# Altium schematic sheet IO_Connector.SchDoc
size A3; CompanyName: Group 19 - AIgle; DrawnBy: Danny Huang; SheetNumber: 1; SheetTotal: 3
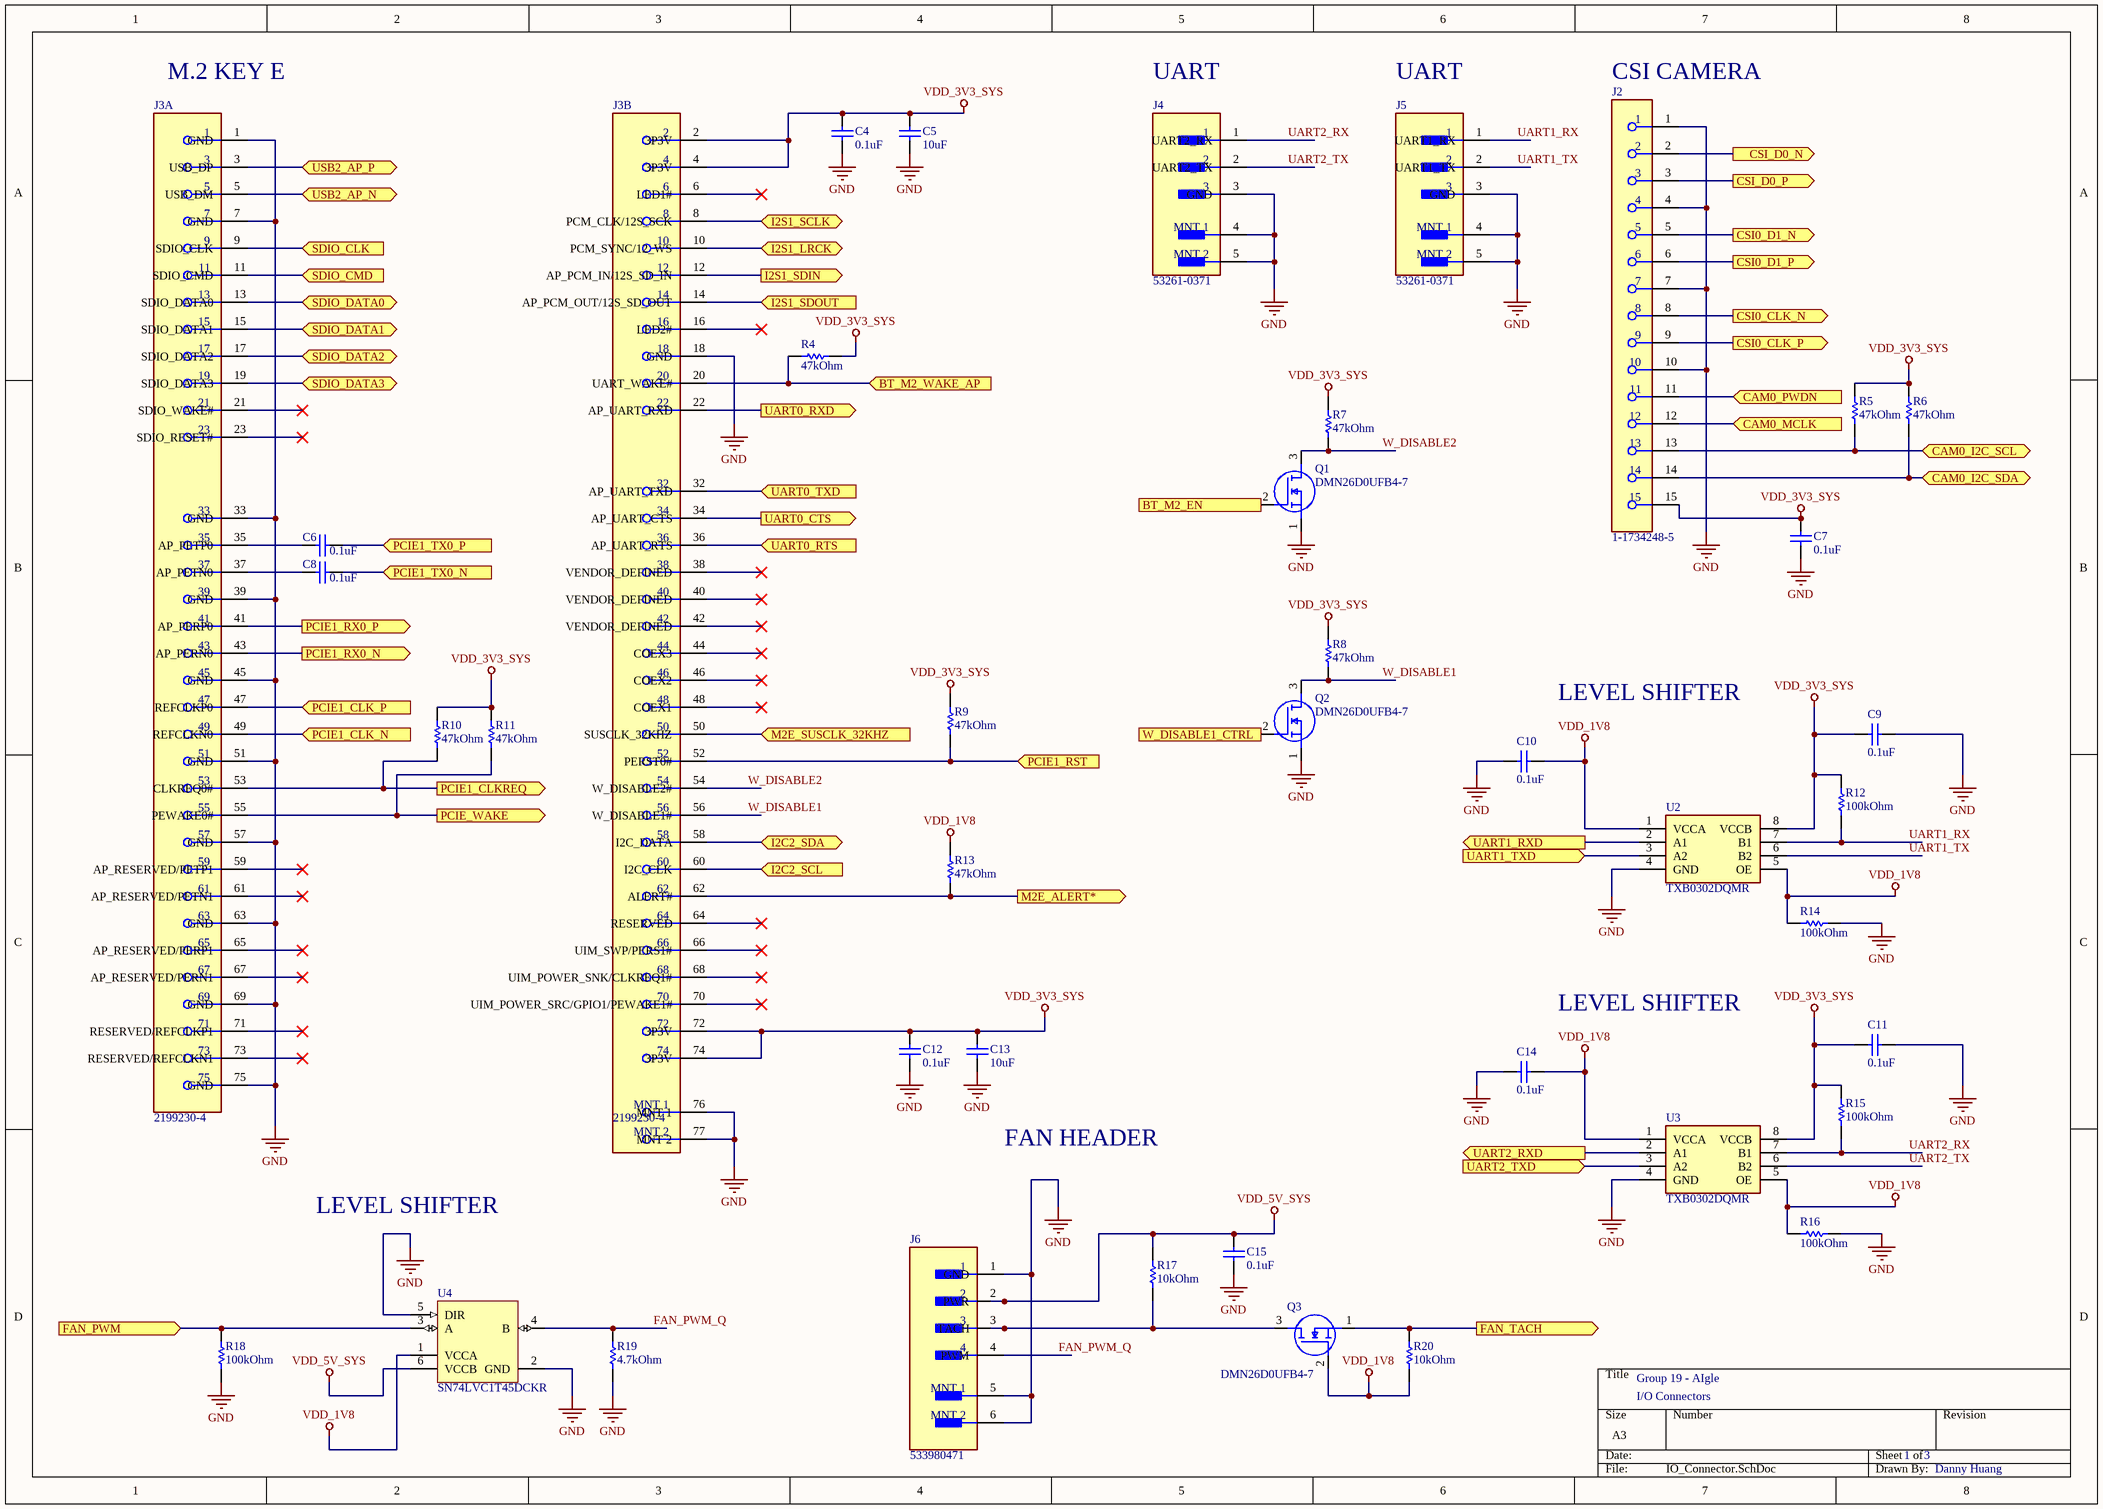
[diagram p0: IO_Connector.SchDoc]

## Parts
C4  0.1uF  [CAPC1005X55X30NL05T10]
C5  10uF  [CAPC1608X90X35NL10T15]
C6  0.1uF  [CAPC1005X55X30NL05T10]
C7  0.1uF  [CAPC1005X55X30NL05T10]
C8  0.1uF  [CAPC1005X55X30NL05T10]
C9  0.1uF  [CAPC1005X55X30NL05T10]
C10  0.1uF  [CAPC1005X55X30NL05T10]
C11  0.1uF  [CAPC1005X55X30NL05T10]
C12  0.1uF  [CAPC1005X55X30NL05T10]
C13  10uF  [CAPC1608X90X35NL10T15]
C14  0.1uF  [CAPC1005X55X30NL05T10]
C15  0.1uF  [CAPC1005X55X30NL05T10]
J2  1-1734248-5  [FP-1-1734248-5-MFG]
J3  2199230-4  [FP-2199230-4-MFG]  (parts A,B of 2)
J4  53261-0371  [FP-53261-0371-MFG]
J5  53261-0371  [FP-53261-0371-MFG]
J6  533980471  [FP-533980471-MFG]
Q1  DMN26D0UFB4-7  [DMN26D0UFB47]
Q2  DMN26D0UFB4-7  [DMN26D0UFB47]
Q3  DMN26D0UFB4-7  [DMN26D0UFB47]
R4  47kOhm  [RESC1005X40X25LL05T05]
R5  47kOhm  [RESC1005X40X25LL05T05]
R6  47kOhm  [RESC1005X40X25LL05T05]
R7  47kOhm  [RESC1005X40X25LL05T05]
R8  47kOhm  [RESC1005X40X25LL05T05]
R9  47kOhm  [RESC1005X40X25LL05T05]
R10  47kOhm  [RESC1005X40X25LL05T05]
R11  47kOhm  [RESC1005X40X25LL05T05]
R12  100kOhm  [RESC1005X40X25ML05T05]
R13  47kOhm  [RESC1005X40X25LL05T05]
R14  100kOhm  [RESC1005X40X25ML05T05]
R15  100kOhm  [RESC1005X40X25ML05T05]
R16  100kOhm  [RESC1005X40X25ML05T05]
R17  10kOhm  [RESC1005X40X25NL05T05]
R18  100kOhm  [RESC1005X40X25ML05T05]
R19  4.7kOhm  [RESC1005X40X25ML05T05]
R20  10kOhm  [RESC1005X40X25NL05T05]
U2  TXB0302DQMR  [SON40P120X180X40-8N]
U3  TXB0302DQMR  [SON40P120X180X40-8N]
U4  SN74LVC1T45DCKR  [DCK0006A_L]

## Ports
BT_M2_EN (in), BT_M2_WAKE_AP (in), CAM0_I2C_SCL (bidir), CAM0_I2C_SDA (bidir), CAM0_MCLK (in), CAM0_PWDN (in), CSI0_CLK_N (out), CSI0_CLK_P (out), CSI0_D1_N (out), CSI0_D1_P (out), CSI_D0_N (out), CSI_D0_P (out), FAN_PWM (in), FAN_TACH (out), I2C2_SCL (in), I2C2_SDA (bidir), I2S1_LRCK (bidir), I2S1_SCLK (bidir), I2S1_SDIN (out), I2S1_SDOUT (in), M2E_ALERT* (out), M2E_SUSCLK_32KHZ (in), PCIE1_CLK_N (in), PCIE1_CLK_P (in), PCIE1_CLKREQ (out), PCIE1_RST (in), PCIE1_RX0_N (out), PCIE1_RX0_P (out), PCIE1_TX0_N (in), PCIE1_TX0_P (in), PCIE_WAKE (out), SDIO_CLK (in), SDIO_CMD (in), SDIO_DATA0 (bidir), SDIO_DATA1 (bidir), SDIO_DATA2 (bidir), SDIO_DATA3 (bidir), UART0_CTS (out), UART0_RTS (in), UART0_RXD (out), UART0_TXD (in), UART1_RXD (out), UART1_TXD (in), UART2_RXD (out), UART2_TXD (in), USB2_AP_N (bidir), USB2_AP_P (bidir), W_DISABLE1_CTRL (in)

## Nets
GND: C4.1 C5.1 C7.1 C9.1 C10.2 C11.1 C12.1 C13.1 C14.2 C15.2 J2.1 J2.4 J2.7 J2.10 J3.1(GND) J3.7(GND) J3.18(GND) J3.33(GND) J3.39(GND) J3.45(GND) J3.51(GND) J3.57(GND) J3.63(GND) J3.69(GND) J3.75(GND) J3.76(MNT_1) J3.77(MNT_2) J4.3(GND) J4.4(MNT_1) J4.5(MNT_2) J5.3(GND) J5.4(MNT_1) J5.5(MNT_2) J6.1(GND) J6.5(MNT_1) J6.6(MNT_2) Q1.1(S) Q2.1(S) R14.1 R16.1 R18.2 R19.1 U2.4(GND) U3.4(GND) U4.2(GND) U4.5(DIR)
VDD_1V8: C10.1 C14.1 Q3.2(G) R13.2 R14.2 R16.2 R20.1 U2.1(VCCA) U2.5(OE) U3.1(VCCA) U3.5(OE) U4.1(VCCA)
VDD_3V3_SYS: C4.2 C5.2 C7.2 C9.2 C11.2 C12.2 C13.2 J2.15 J3.2(3P3V) J3.4(3P3V) J3.72(3P3V) J3.74(3P3V) R4.1 R5.2 R6.2 R7.2 R8.2 R9.2 R10.2 R11.2 R12.2 R15.2 U2.8(VCCB) U3.8(VCCB)
VDD_5V_SYS: C15.1 J6.2(PWR) R17.2 U4.6(VCCB)
BT_M2_EN: Q1.2(G) ; port BT_M2_EN
BT_M2_WAKE_AP: J3.20(UART_WAKE#) R4.2 ; port BT_M2_WAKE_AP
CAM0_I2C_SCL: J2.13 R5.1 ; port CAM0_I2C_SCL
CAM0_I2C_SDA: J2.14 R6.1 ; port CAM0_I2C_SDA
CAM0_MCLK: J2.12 ; port CAM0_MCLK
CAM0_PWDN: J2.11 ; port CAM0_PWDN
CSI0_CLK_N: J2.8 ; port CSI0_CLK_N
CSI0_CLK_P: J2.9 ; port CSI0_CLK_P
CSI0_D1_N: J2.5 ; port CSI0_D1_N
CSI0_D1_P: J2.6 ; port CSI0_D1_P
CSI_D0_N: J2.2 ; port CSI_D0_N
CSI_D0_P: J2.3 ; port CSI_D0_P
FAN_PWM: R18.1 U4.3(A) ; port FAN_PWM
FAN_PWM_Q: J6.4(PWM) R19.2 U4.4(B)
FAN_TACH: Q3.1(S) R20.2 ; port FAN_TACH
I2C2_SCL: J3.60(I2C_CLK) ; port I2C2_SCL
I2C2_SDA: J3.58(I2C_DATA) ; port I2C2_SDA
I2S1_LRCK: J3.10(PCM_SYNC/12_WS) ; port I2S1_LRCK
I2S1_SCLK: J3.8(PCM_CLK/12S_SCK) ; port I2S1_SCLK
I2S1_SDIN: J3.12(AP_PCM_IN/12S_SD_IN) ; port I2S1_SDIN
I2S1_SDOUT: J3.14(AP_PCM_OUT/12S_SD_OUT) ; port I2S1_SDOUT
M2E_ALERT*: J3.62(ALERT#) R13.1 ; port M2E_ALERT*
M2E_SUSCLK_32KHZ: J3.50(SUSCLK_32KHZ) ; port M2E_SUSCLK_32KHZ
PCIE1_CLK_N: J3.49(REFCLKN0) ; port PCIE1_CLK_N
PCIE1_CLK_P: J3.47(REFCLKP0) ; port PCIE1_CLK_P
PCIE1_CLKREQ: J3.53(CLKREQ0#) R10.1 ; port PCIE1_CLKREQ
PCIE1_RST: J3.52(PERST0#) R9.1 ; port PCIE1_RST
PCIE1_RX0_N: J3.43(AP_PERN0) ; port PCIE1_RX0_N
PCIE1_RX0_P: J3.41(AP_PERP0) ; port PCIE1_RX0_P
PCIE1_TX0_N: C8.1 ; port PCIE1_TX0_N
PCIE1_TX0_P: C6.1 ; port PCIE1_TX0_P
PCIE_WAKE: J3.55(PEWAKE0#) R11.1 ; port PCIE_WAKE
SDIO_CLK: J3.9(SDIO_CLK) ; port SDIO_CLK
SDIO_CMD: J3.11(SDIO_CMD) ; port SDIO_CMD
SDIO_DATA0: J3.13(SDIO_DATA0) ; port SDIO_DATA0
SDIO_DATA1: J3.15(SDIO_DATA1) ; port SDIO_DATA1
SDIO_DATA2: J3.17(SDIO_DATA2) ; port SDIO_DATA2
SDIO_DATA3: J3.19(SDIO_DATA3) ; port SDIO_DATA3
UART0_CTS: J3.34(AP_UART_CTS) ; port UART0_CTS
UART0_RTS: J3.36(AP_UART_RTS) ; port UART0_RTS
UART0_RXD: J3.22(AP_UART_RXD) ; port UART0_RXD
UART0_TXD: J3.32(AP_UART_TXD) ; port UART0_TXD
UART1_RX: J5.1(UART1_RX) R12.1 U2.7(B1)
UART1_RXD: U2.2(A1) ; port UART1_RXD
UART1_TX: J5.2(UART1_TX) U2.6(B2)
UART1_TXD: U2.3(A2) ; port UART1_TXD
UART2_RX: J4.1(UART2_RX) R15.1 U3.7(B1)
UART2_RXD: U3.2(A1) ; port UART2_RXD
UART2_TX: J4.2(UART2_TX) U3.6(B2)
UART2_TXD: U3.3(A2) ; port UART2_TXD
USB2_AP_N: J3.5(USB_DM) ; port USB2_AP_N
USB2_AP_P: J3.3(USB_DP) ; port USB2_AP_P
W_DISABLE1: J3.56(W_DISABLE1#) Q2.3(D) R8.1
W_DISABLE1_CTRL: Q2.2(G) ; port W_DISABLE1_CTRL
W_DISABLE2: J3.54(W_DISABLE2#) Q1.3(D) R7.1
NetC6_2: C6.2 J3.35(AP_PETP0)
NetC8_2: C8.2 J3.37(AP_PETN0)
NetJ6_3: J6.3(TACH) Q3.3(D) R17.1

Not connected (* = marked no-connect by the designer): J3 6(LED1#)* 16(LED2#)* 21(SDIO_WAKE#)* 23(SDIO_RESET#)* 38(VENDOR_DEFINED)* 40(VENDOR_DEFINED)* 42(VENDOR_DEFINED)* 44(COEX3)* 46(COEX2)* 48(COEX1)* 59(AP_RESERVED/PETP1)* 61(AP_RESERVED/PETN1)* 64(RESERVED)* 65(AP_RESERVED/PERP1)* 66(UIM_SWP/PERS1#)* 67(AP_RESERVED/PERN1)* 68(UIM_POWER_SNK/CLKREQ1#)* 70(UIM_POWER_SRC/GPIO1/PEWAKE1#)* 71(RESERVED/REFCLKP1)* 73(RESERVED/REFCLKN1)*

## Notes on the sheet
- M.2 KEY E
- UART
- (near J2) CSI CAMERA
- LEVEL SHIFTER
- FAN HEADER
- I/O Connectors

## Library data of the parts
C4 C6-C12 C14 C15 = CMP-2008-03087-1: Manufacturer: Kemet; Part Number: C0402C104K9RACTU
C5 C13 = CMP-2006-02792-1: Part Number: GRM188R60J106ME47D; Manufacturer: Murata
J2 = CMP-03368-000001-1: CONN FPC VERT 15POS 1.00MM SMD; Manufacturer: TE; Conn Orientation: Vertical; Conn Gender: Female; Current Rating: 1A; Is Female: yes; Number Of Contacts: 15; Pitch: 1mm; Voltage Rating: 125V; ComponentLink2URL: https://www.te.com/commerce/DocumentDelivery/DDEController?Action=showdoc&DocId=Customer+Drawing%7F1734248%7FE1%7Fpdf%7FEnglish%7FENG_CD_1734248_E1__.pdf%7F1-1734248-5; Device Class L1: Connectors; Category: Conn; Package: 0; Lead Free: Yes; Digikey Description: CONN FPC VERT 15POS 1.00MM SMD; Height: 8mm; Manufacturer Part Number: 1-1734248-5; Temperature: -20°C to +85°C; Contact Material: Gold,Nickel; Device Class L3: unset; ComponentLink2Description: Datasheet; RoHS: TRUE; Temperature Range Low: -20°C; Octopart: https://octopart.com/1-1734248-5-te+connectivity-40620898; Device Class L2: FFC / FPC; Mouser Description: FFC & FPC Connectors 15P 1.0 FPC, Zip V/T SMT; Automotive: No; Temperature Range High: +85°C; Mounting Type: Surface Mount
J3 = CMP-03365-000002-1: CONN FEMALE 67POS 0.020 GOLD; Manufacturer: TE Connectivity; Conn Orientation: Right Angle; Pitch: 0.5mm; Number Of Contacts: 67; Voltage Rating: 50V; Is Female: yes; Current Rating: 0.5A; Lead Free: Yes; Temperature Range Low: -40°C; Device Class L3: unset; Package: 0; Manufacturer Part Number: 2199230-4; RoHS: TRUE; Digikey Description: CONN FEMALE 67POS 0.020 GOLD; Category: Conn; Device Class L1: Connectors; Temperature Range High: +80°C; ComponentLink2Description: Datasheet; ComponentLink2URL: https://www.te.com/commerce/DocumentDelivery/DDEController?Action=showdoc&DocId=Customer+Drawing%7F2199230%7FB3%7Fpdf%7FEnglish%7FENG_CD_2199230_B3.pdf%7F2199230-4; Mouser Description: PCI Express / PCI Connectors .5PITCH 4.2H KEY E EMBOSS NGFF MINICARD; Automotive: No; Conn Gender: Female; Height: 4.2mm; Device Class L2: Card Edge Connectors; Contact Material: Gold,Nickel; Number Of Rows: 2; Octopart: https://octopart.com/2199230-4-te+connectivity-46436156; Temperature: -40°C to +80°C
J4 J5 = CMP-04776-000071-1: CONN HEADER SMD R/A 3POS 1.25MM; Manufacturer: Molex; Number Of Contacts: 3; Conn Orientation: Right Angle; Current Rating: 1A; Voltage Rating: 125V; Conn Gender: Male; Category: Conn; Automotive: No; Footprint Url: https://www.molex.com/pdm_docs/sd/532610371_sd.pdf; Height: 3.6mm; Number Of Rows: 1; Temperature Range Low: -40°C; Package: 0; Octopart: https://octopart.com/53261-0371-molex-655314; ComponentLink2Description: Datasheet; Lead Free: Yes; Ambient Temperature Range Low: -40°C; Device Class L3: unset; Mouser Description: 1.25mm (.049") Pitch PicoBlade Header, Surface Mount, Right Angle, Lead-free, 3 Circuits; Digikey Description: CONN HEADER SMD R/A 3POS 1.25MM; Device Class L2: Headers and Wire Housings; Contact Material: Tin,Nickel; Manufacturer Part Number: 53261-0371; Ambient Temperature Range High: +105°C; ComponentLink2URL: https://www.molex.com/webdocs/datasheets/pdf/en-us/0532610371_PCB_HEADERS.pdf; Pitch: 1.25mm; Temperature: -40°C to +105°C; RoHS: TRUE; Device Class L1: Connectors; Temperature Range High: +105°C
J6 = CMP-04776-000105-1: CONN HEADER SMD 4POS 1.25MM; Manufacturer: Molex; Conn Gender: Male; Conn Orientation: Vertical; Standoff Height: 0.05mm; Number Of Contacts: 4; Current Rating: 1A; Voltage Rating: 125V; Package: 0; ComponentLink2Description: Datasheet; ComponentLink2URL: https://www.molex.com/pdm_docs/ps/PS-51021-024-001.pdf; Ambient Temperature Range Low: -40°C; Category: Conn; Automotive: No; Number Of Rows: 1; Device Class L3: unset; Ambient Temperature Range High: +105°C; Height: 5.1mm; Lead Free: Yes; Pitch: 1.25mm; Contact Material: Tin; Footprint Url: https://www.molex.com/pdm_docs/sd/533980471_sd.pdf; Octopart: https://octopart.com/53398-0471-molex-655296; Temperature Range Low: -40°C; Device Class L2: Headers and Wire Housings; Temperature: -40°C to +105°C; Digikey Description: CONN HEADER SMD 4POS 1.25MM; RoHS: TRUE; Manufacturer Part Number: 533980471; Device Class L1: Connectors; Temperature Range High: +105°C
Q1-Q3 = DMN26D0UFB4-7: MOSFET (N-Channel); Manufacturer_Name: Diodes Inc.; Datasheet Link: https://componentsearchengine.com/Datasheets/1/DMN26D0UFB4-7.pdf; Height: 0.4mm; Manufacturer_Part_Number: DMN26D0UFB4-7; Arrow Part Number: DMN26D0UFB4-7; Arrow Price/Stock: https://www.arrow.com/en/products/dmn26d0ufb4-7/diodes-incorporated; Mouser Part Number: 621-DMN26D0UFB4-7; Mouser Price/Stock: https://www.mouser.co.uk/ProductDetail/Diodes-Incorporated/DMN26D0UFB4-7?qs=GWgl%252BsiMZr%252B4pznsTuF3iQ%3D%3D
R4-R11 R13 = CMP-2002-00026-1: Manufacturer: Vishay Dale; Part Number: CRCW040247K0JNED
R12 R14-R16 R18 = CMP-2002-08123-2: Chip Resistor, 100 KOhm, +/- 1%, 0.63 W, -55 to 155 degC, 0402 (1005 Metric), RoHS, Tape and Reel; Voltage Rating: 50 V; Type (Resistor): Thick Film; Power Rating: 63 mW; Case\Package: 0402; Mount: Surface Mount; Packaging: Tape and Reel; Weight: 2.3E-05 oz; PackageDescription: 2-Pin Surface Mount Device, Body 1 x 0.5 mm; ComponentLink1Description: Manufacturer URL; ComponentLink2Description: Datasheet; Min Operating Temperature: -55 degC; Width: 0.5 mm; Resistance: 100 kohm; REACH SVHC: Unknown; ComponentLink2URL: http://www.vishay.com/docs/20035/dcrcwe3.pdf; Package Quantity: 10000; Mounting Technology: Surface Mount; PackageReference: 0402; ComponentLink1URL: http://www.vishay.com/; Max Operating Temperature: 155 degC; Length: 1 mm; DatasheetVersion: 06/2012; Height: 0.35 mm; Case Code (Imperial): 0402; Pins: 2; Tolerance: 1%; Case Code (Metric): 1005; Radiation Hardening: No; RoHSCompliant: true
R17 R20 = CMP-2002-08136-1: Manufacturer: Vishay Dale; Part Number: CRCW040210K0JNED
R19 = CMP-2002-00053-1: Part Number: CRCW04024K70JNED; Manufacturer: Vishay BCcomponents
U2 U3 = TXB0302DQMR: Integrated Circuit; Manufacturer_Name: Texas Instruments; Datasheet Link: http://www.ti.com/lit/gpn/txb0302; Height: 0.4mm; Manufacturer_Part_Number: TXB0302DQMR; Arrow Part Number: TXB0302DQMR; Arrow Price/Stock: https://www.arrow.com/en/products/txb0302dqmr/texas-instruments; Mouser Part Number: 595-TXB0302DQMR; Mouser Price/Stock: https://www.mouser.co.uk/ProductDetail/Texas-Instruments/TXB0302DQMR?qs=5771e39Rz9HEpqtrmqNQ0Q%3D%3D
U4 = CMP-0859-00452-3: Single-Bit Dual-Supply Bus Transceiver with Configurable Voltage Translation and 3-State Outputs, DCK0006A, LARGE T&R; Manufacturer: Texas Instruments; Rating: Catalog; Output Type: CMOS; Technology Family: LVC; Voltage(Nom)(V): 1.8,2.5,3.3,5; VCC(Max)(V): 5.5; 3-State Output: Yes; Bits(#): 1; F @ Nom Voltage(Max)(Mhz): 150; VCC(Min)(V): 1.65; ICC @ Nom Voltage(Max)(mA): 0.004; Schmitt Trigger: No; Input Type: CMOS/TTL; tpd @ Nom Voltage(Max)(ns): 15.5,8,5.8,4.4; Logic: True; Output Drive (IOL/IOH)(Max)(mA): 32/-32; Sub-Family: Dual Supply Translator; PackageReference: DCK0006A; Generic Part Number: SN74LVC1T45; DatasheetVersion: SCES515K; Operating Temperature Range(C): -40 to 85